# Altium schematic sheet Alarm Clock Shematic.SchDoc
size B; SheetNumber: 1; SheetTotal: 1
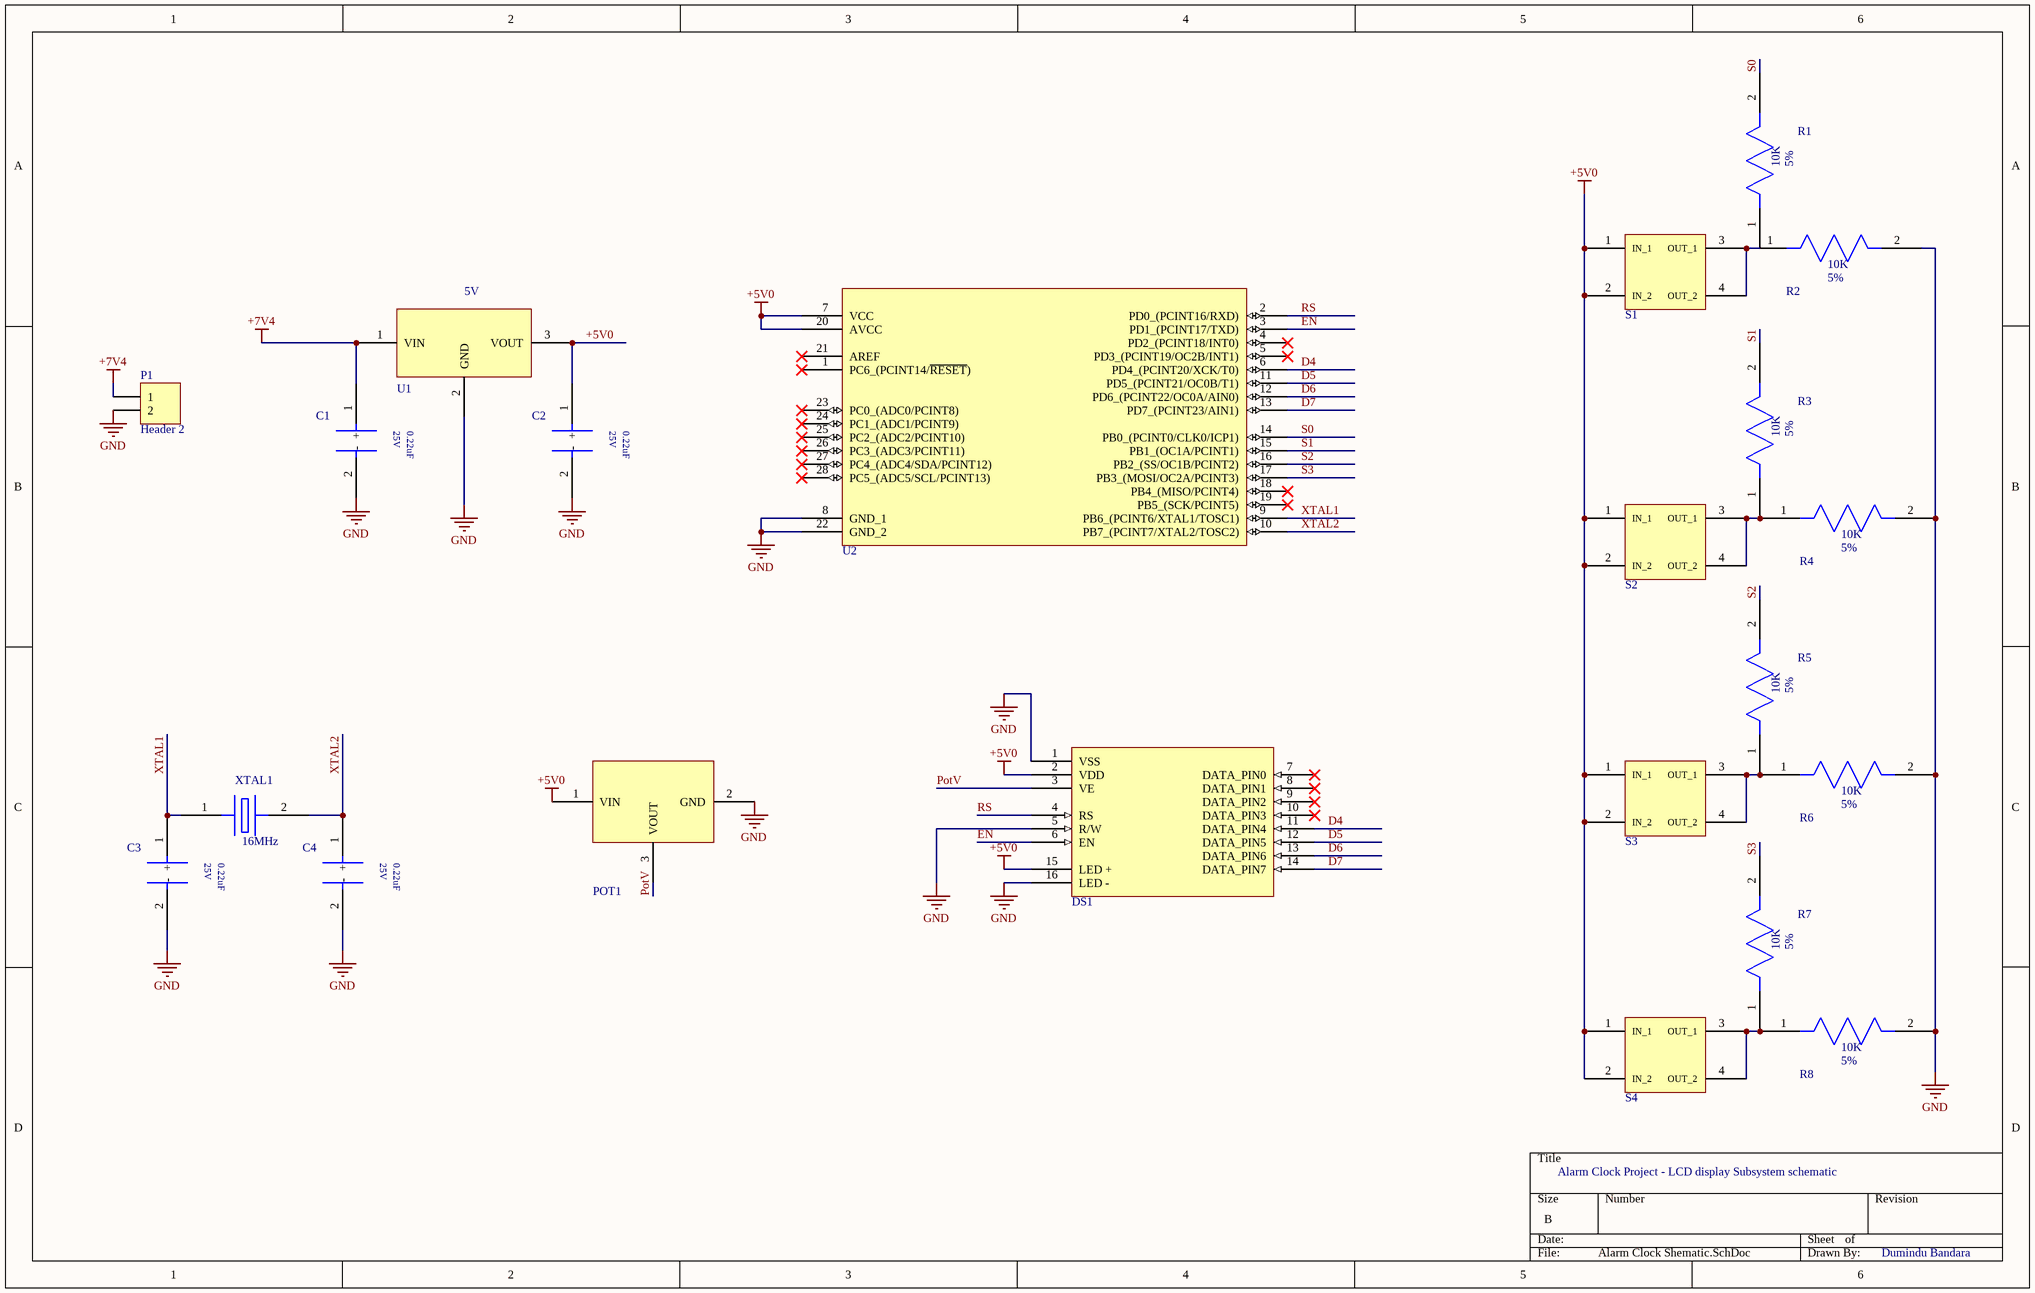
[diagram p0: Alarm Clock Shematic.SchDoc]

## Parts
C1  Capacitor  [UMP1HR22MDD1TP]  (value not drawn)
C2  Capacitor  [UMP1HR22MDD1TP]  (value not drawn)
C3  Capacitor  [UMP1HR22MDD1TP]  (value not drawn)
C4  Capacitor  [UMP1HR22MDD1TP]  (value not drawn)
DS1  LM016L  [LCD DISPLAY]  (value not drawn)
P1  Header 2  [HDR1X2]
POT1  Variable Resistor  [10k Trimmer]  (value not drawn)
R1  Resistor  [RESAD975W59L900D300]  (value not drawn)
R2  Resistor  [RESAD975W59L900D300]  (value not drawn)
R3  Resistor  [RESAD975W59L900D300]  (value not drawn)
R4  Resistor  [RESAD975W59L900D300]  (value not drawn)
R5  Resistor  [RESAD975W59L900D300]  (value not drawn)
R6  Resistor  [RESAD975W59L900D300]  (value not drawn)
R7  Resistor  [RESAD975W59L900D300]  (value not drawn)
R8  Resistor  [RESAD975W59L900D300]  (value not drawn)
S1  Push Button - SPST  [PUSH BUTTON]  (value not drawn)
S2  Push Button - SPST  [PUSH BUTTON]  (value not drawn)
S3  Push Button - SPST  [PUSH BUTTON]  (value not drawn)
S4  Push Button - SPST  [PUSH BUTTON]  (value not drawn)
U1  7805 Voltage Regulator  [TO255P1040X460X1968-3]  (value not drawn)
U2  Atmega 328P U  [DIP793W45P254L3479H457Q28]  (value not drawn)
XTAL1  Crystal  [ECS-160-20-4VX]  (value not drawn)

## Nets
+5V0: C2.1(+) DS1.2(VDD) DS1.15(LED_+) POT1.1(VIN) S1.1(IN_1) S1.2(IN_2) S2.1(IN_1) S2.2(IN_2) S3.1(IN_1) S3.2(IN_2) S4.1(IN_1) S4.2(IN_2) U1.3(VOUT) U2.7(VCC) U2.20(AVCC)
+7V4: C1.1(+) P1.1 U1.1(VIN)
GND: C1.2(-) C2.2(-) C3.2(-) C4.2(-) DS1.1(VSS) DS1.5(R/W) DS1.16(LED_-) P1.2 POT1.2(GND) R2.2 R4.2 R6.2 R8.2 U1.2(GND) U2.8(GND_1) U2.22(GND_2)
D4: DS1.11(DATA_PIN4) U2.6(PD4_(PCINT20/XCK/T0))
D5: DS1.12(DATA_PIN5) U2.11(PD5_(PCINT21/OC0B/T1))
D6: DS1.13(DATA_PIN6) U2.12(PD6_(PCINT22/OC0A/AIN0))
D7: DS1.14(DATA_PIN7) U2.13(PD7_(PCINT23/AIN1))
EN: DS1.6(EN) U2.3(PD1_(PCINT17/TXD))
PotV: DS1.3(VE) POT1.3(VOUT)
RS: DS1.4(RS) U2.2(PD0_(PCINT16/RXD))
S0: R1.2 U2.14(PB0_(PCINT0/CLK0/ICP1))
S1: R3.2 U2.15(PB1_(OC1A/PCINT1))
S2: R5.2 U2.16(PB2_(SS/OC1B/PCINT2))
S3: R7.2 U2.17(PB3_(MOSI/OC2A/PCINT3))
XTAL1: C3.1(+) U2.9(PB6_(PCINT6/XTAL1/TOSC1)) XTAL1.1
XTAL2: C4.1(+) U2.10(PB7_(PCINT7/XTAL2/TOSC2)) XTAL1.2
NetR1_1: R1.1 R2.1 S1.3(OUT_1) S1.4(OUT_2)
NetR3_1: R3.1 R4.1 S2.3(OUT_1) S2.4(OUT_2)
NetR5_1: R5.1 R6.1 S3.3(OUT_1) S3.4(OUT_2)
NetR7_1: R7.1 R8.1 S4.3(OUT_1) S4.4(OUT_2)

Not connected (* = marked no-connect by the designer): DS1 7(DATA_PIN0)* 8(DATA_PIN1)* 9(DATA_PIN2)* 10(DATA_PIN3)*; U2 1(PC6_(PCINT14/~{RESET}))* 4(PD2_(PCINT18/INT0))* 5(PD3_(PCINT19/OC2B/INT1))* 18(PB4_(MISO/PCINT4))* 19(PB5_(SCK/PCINT5))* 21(AREF)* 23(PC0_(ADC0/PCINT8))* 24(PC1_(ADC1/PCINT9))* 25(PC2_(ADC2/PCINT10))* 26(PC3_(ADC3/PCINT11))* 27(PC4_(ADC4/SDA/PCINT12))* 28(PC5_(ADC5/SCL/PCINT13))*

## Notes on the sheet
- Alarm Clock Project - LCD display Subsystem schematic
- Dumindu Bandara

## Library data of the parts
C1-C4 = Capacitor: Generic Capacitor; Value: 0.22uF; Voltage: 25V; Polarity: Polarized; Manufacturer: *
DS1 = LM016L: 16x2 LCD display with character size 5x8
P1 = Header 2: Header, 2-Pin; LatestRevisionDate: 17-Jul-2002; LatestRevisionNote: Re-released for DXP Platform.; Publisher: Altium Limited
R1-R8 = Resistor: Generic Resistor; Value: 10K; Tolerance: 5%
S1-S4 = Push Button - SPST: Microswitch - SPST
U1 = 7805 Voltage Regulator: Linear 5V voltage regulator.; Value: 5V; Maximum Input: *; Minimum Input: *
U2 = Atmega 328P U: AVR series Microcontroller IC 8-Bit 20MHz 32KB (16K x 16) FLASH 28-PDIP; IC type: AtMega 328p - 28spdip
XTAL1 = Crystal: Crystal Oscillator; Frequency: 16MHz